# Altium schematic sheet Sample_Int.SchDoc
size A; DocumentNumber: 3; SheetNumber: 3; SheetTotal: 4
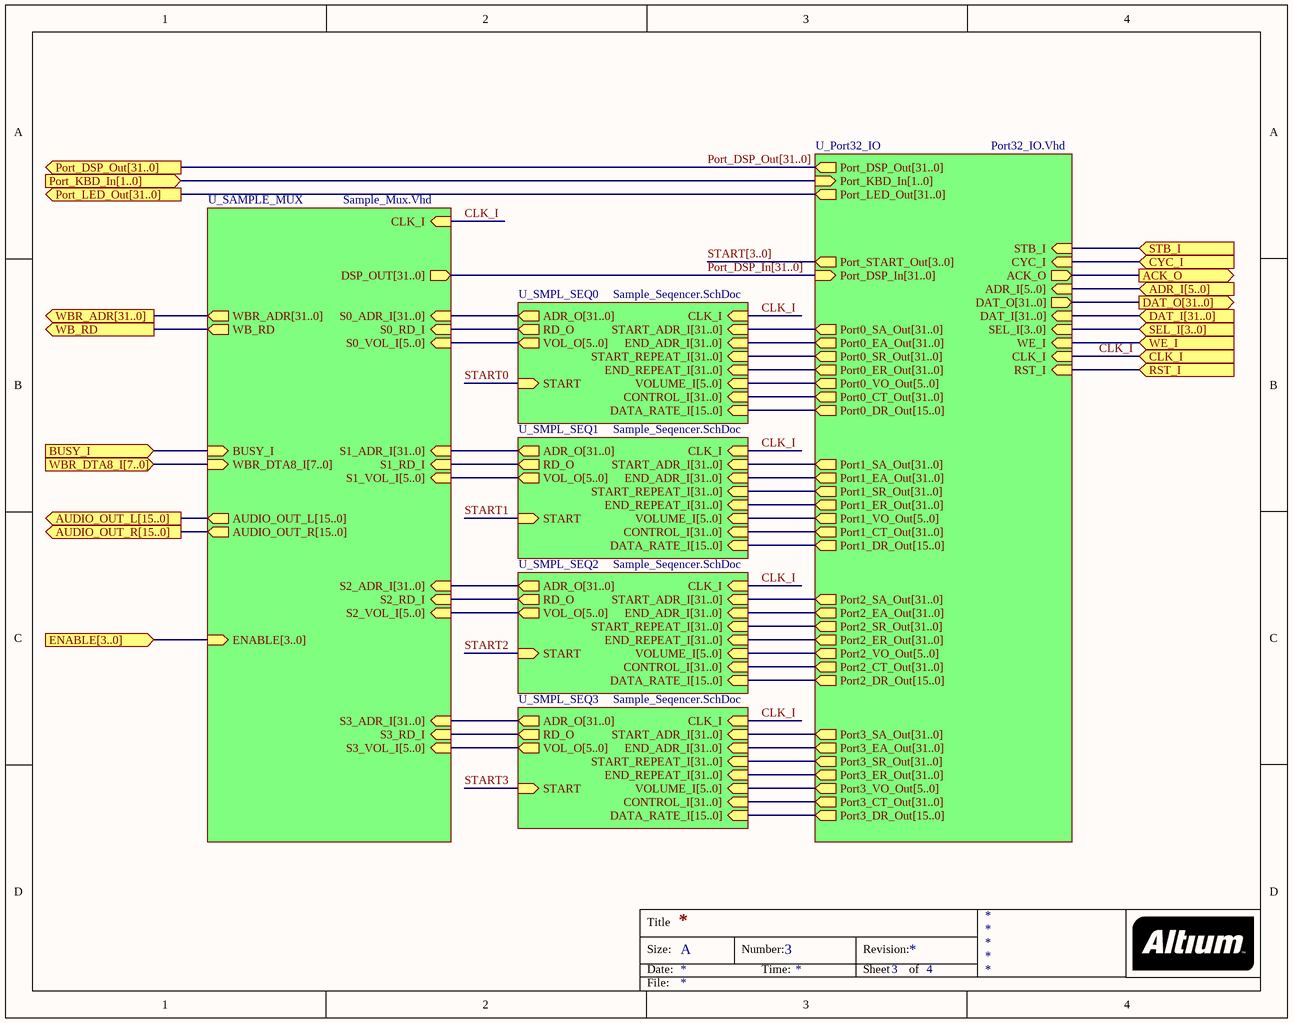
[diagram p0: Sample_Int.SchDoc]

## Sub-sheets
U_Port32_IO = Port32_IO.Vhd: Port_DSP_In[31..0] (in), Port0_SA_Out[31..0] (out), Port_DSP_Out[31..0] (out), Port0_EA_Out[31..0] (out), Port0_SR_Out[31..0] (out), Port0_ER_Out[31..0] (out), STB_I (in), WE_I (in), DAT_O[31..0] (out), DAT_I[31..0] (in), ADR_I[5..0] (in), SEL_I[3..0] (in), CLK_I (in), RST_I (in), ACK_O (out), CYC_I (in), Port0_VO_Out[5..0] (out), Port0_CT_Out[31..0] (out), Port0_DR_Out[15..0] (out), Port1_VO_Out[5..0] (out), Port1_SR_Out[31..0] (out), Port1_CT_Out[31..0] (out), Port1_ER_Out[31..0] (out), Port1_EA_Out[31..0] (out), Port1_SA_Out[31..0] (out), Port1_DR_Out[15..0] (out), Port2_VO_Out[5..0] (out), Port2_SR_Out[31..0] (out), Port2_CT_Out[31..0] (out), Port2_ER_Out[31..0] (out), Port2_EA_Out[31..0] (out), Port2_SA_Out[31..0] (out), Port2_DR_Out[15..0] (out), Port3_VO_Out[5..0] (out), Port3_SR_Out[31..0] (out), Port3_CT_Out[31..0] (out), Port3_ER_Out[31..0] (out), Port3_EA_Out[31..0] (out), Port3_SA_Out[31..0] (out), Port3_DR_Out[15..0] (out), Port_KBD_In[1..0] (in), Port_START_Out[3..0] (out), Port_LED_Out[31..0] (out)
U_SAMPLE_MUX = Sample_Mux.Vhd: S0_ADR_I[31..0] (in), S0_RD_I (in), WBR_ADR[31..0] (out), WB_RD (out), WBR_DTA8_I[7..0] (in), AUDIO_OUT_L[15..0] (out), AUDIO_OUT_R[15..0] (out), S1_ADR_I[31..0] (in), S2_ADR_I[31..0] (in), S3_ADR_I[31..0] (in), S1_RD_I (in), S2_RD_I (in), S3_RD_I (in), ENABLE[3..0] (in), CLK_I (in), BUSY_I (in), DSP_OUT[31..0] (out), S0_VOL_I[5..0] (in), S1_VOL_I[5..0] (in), S2_VOL_I[5..0] (in), S3_VOL_I[5..0] (in)
U_SMPL_SEQ0 = Sample_Seqencer.SchDoc: START_ADR_I[31..0] (in), END_ADR_I[31..0] (in), START_REPEAT_I[31..0] (in), END_REPEAT_I[31..0] (in), VOLUME_I[5..0] (in), CONTROL_I[31..0] (in), DATA_RATE_I[15..0] (in), CLK_I (in), ADR_O[31..0] (out), RD_O (out), START (in), VOL_O[5..0] (out)
U_SMPL_SEQ1 = Sample_Seqencer.SchDoc: START_ADR_I[31..0] (in), END_ADR_I[31..0] (in), START_REPEAT_I[31..0] (in), END_REPEAT_I[31..0] (in), VOLUME_I[5..0] (in), CONTROL_I[31..0] (in), DATA_RATE_I[15..0] (in), CLK_I (in), ADR_O[31..0] (out), RD_O (out), START (in), VOL_O[5..0] (out)
U_SMPL_SEQ2 = Sample_Seqencer.SchDoc: START_ADR_I[31..0] (in), END_ADR_I[31..0] (in), START_REPEAT_I[31..0] (in), END_REPEAT_I[31..0] (in), VOLUME_I[5..0] (in), CONTROL_I[31..0] (in), DATA_RATE_I[15..0] (in), CLK_I (in), ADR_O[31..0] (out), RD_O (out), START (in), VOL_O[5..0] (out)
U_SMPL_SEQ3 = Sample_Seqencer.SchDoc: START_ADR_I[31..0] (in), END_ADR_I[31..0] (in), START_REPEAT_I[31..0] (in), END_REPEAT_I[31..0] (in), VOLUME_I[5..0] (in), CONTROL_I[31..0] (in), DATA_RATE_I[15..0] (in), CLK_I (in), ADR_O[31..0] (out), RD_O (out), START (in), VOL_O[5..0] (out)

## Ports
ACK_O (out), ADR_I[5..0] (in), AUDIO_OUT_L[15..0] (out), AUDIO_OUT_R[15..0] (out), BUSY_I (in), CLK_I (in), CYC_I (in), DAT_I[31..0] (in), DAT_O[31..0] (out), ENABLE[3..0] (in), Port_DSP_Out[31..0] (out), Port_KBD_In[1..0] (in), Port_LED_Out[31..0] (out), RST_I (in), SEL_I[3..0] (in), STB_I (in), WB_RD (out), WBR_ADR[31..0] (out), WBR_DTA8_I[7..0] (in), WE_I (in)

## Nets
ACK_O: port ACK_O, sheet U_Port32_IO/ACK_O
BUSY_I: port BUSY_I, sheet U_SAMPLE_MUX/BUSY_I
CLK_I: port CLK_I, sheet U_Port32_IO/CLK_I, sheet U_SMPL_SEQ0/CLK_I, sheet U_SAMPLE_MUX/CLK_I, sheet U_SMPL_SEQ1/CLK_I, sheet U_SMPL_SEQ2/CLK_I, sheet U_SMPL_SEQ3/CLK_I
CYC_I: port CYC_I, sheet U_Port32_IO/CYC_I
RST_I: port RST_I, sheet U_Port32_IO/RST_I
START0: sheet U_SMPL_SEQ0/START
START1: sheet U_SMPL_SEQ1/START
START2: sheet U_SMPL_SEQ2/START
START3: sheet U_SMPL_SEQ3/START
STB_I: port STB_I, sheet U_Port32_IO/STB_I
WB_RD: port WB_RD, sheet U_SAMPLE_MUX/WB_RD
WE_I: port WE_I, sheet U_Port32_IO/WE_I
(unnamed): sheet U_SMPL_SEQ0/RD_O, sheet U_SAMPLE_MUX/S0_RD_I
(unnamed): sheet U_SAMPLE_MUX/S1_RD_I, sheet U_SMPL_SEQ1/RD_O
(unnamed): sheet U_SAMPLE_MUX/S2_RD_I, sheet U_SMPL_SEQ2/RD_O
(unnamed): sheet U_SAMPLE_MUX/S3_RD_I, sheet U_SMPL_SEQ3/RD_O

## Buses and harness runs
bus port ADR_I[5..0] = sheet U_Port32_IO/ADR_I[5..0]
bus port AUDIO_OUT_L[15..0] = sheet U_SAMPLE_MUX/AUDIO_OUT_L[15..0]
bus port AUDIO_OUT_R[15..0] = sheet U_SAMPLE_MUX/AUDIO_OUT_R[15..0]
bus port DAT_I[31..0] = sheet U_Port32_IO/DAT_I[31..0]
bus port DAT_O[31..0] = sheet U_Port32_IO/DAT_O[31..0]
bus port ENABLE[3..0] = sheet U_SAMPLE_MUX/ENABLE[3..0]
bus port Port_KBD_In[1..0] = sheet U_Port32_IO/Port_KBD_In[1..0]
bus port Port_LED_Out[31..0] = sheet U_Port32_IO/Port_LED_Out[31..0]
bus port SEL_I[3..0] = sheet U_Port32_IO/SEL_I[3..0]
bus port WBR_ADR[31..0] = sheet U_SAMPLE_MUX/WBR_ADR[31..0]
bus port WBR_DTA8_I[7..0] = sheet U_SAMPLE_MUX/WBR_DTA8_I[7..0]
bus Port_DSP_In[31..0] = sheet U_Port32_IO/Port_DSP_In[31..0] = sheet U_SAMPLE_MUX/DSP_OUT[31..0]
bus Port_DSP_Out[31..0] = port Port_DSP_Out[31..0] = sheet U_Port32_IO/Port_DSP_Out[31..0]
bus sheet U_Port32_IO/Port0_CT_Out[31..0] = sheet U_SMPL_SEQ0/CONTROL_I[31..0]
bus sheet U_Port32_IO/Port0_DR_Out[15..0] = sheet U_SMPL_SEQ0/DATA_RATE_I[15..0]
bus sheet U_Port32_IO/Port0_EA_Out[31..0] = sheet U_SMPL_SEQ0/END_ADR_I[31..0]
bus sheet U_Port32_IO/Port0_ER_Out[31..0] = sheet U_SMPL_SEQ0/END_REPEAT_I[31..0]
bus sheet U_Port32_IO/Port0_SA_Out[31..0] = sheet U_SMPL_SEQ0/START_ADR_I[31..0]
bus sheet U_Port32_IO/Port0_SR_Out[31..0] = sheet U_SMPL_SEQ0/START_REPEAT_I[31..0]
bus sheet U_Port32_IO/Port0_VO_Out[5..0] = sheet U_SMPL_SEQ0/VOLUME_I[5..0]
bus sheet U_Port32_IO/Port1_CT_Out[31..0] = sheet U_SMPL_SEQ1/CONTROL_I[31..0]
bus sheet U_Port32_IO/Port1_DR_Out[15..0] = sheet U_SMPL_SEQ1/DATA_RATE_I[15..0]
bus sheet U_Port32_IO/Port1_EA_Out[31..0] = sheet U_SMPL_SEQ1/END_ADR_I[31..0]
bus sheet U_Port32_IO/Port1_ER_Out[31..0] = sheet U_SMPL_SEQ1/END_REPEAT_I[31..0]
bus sheet U_Port32_IO/Port1_SA_Out[31..0] = sheet U_SMPL_SEQ1/START_ADR_I[31..0]
bus sheet U_Port32_IO/Port1_SR_Out[31..0] = sheet U_SMPL_SEQ1/START_REPEAT_I[31..0]
bus sheet U_Port32_IO/Port1_VO_Out[5..0] = sheet U_SMPL_SEQ1/VOLUME_I[5..0]
bus sheet U_Port32_IO/Port2_CT_Out[31..0] = sheet U_SMPL_SEQ2/CONTROL_I[31..0]
bus sheet U_Port32_IO/Port2_DR_Out[15..0] = sheet U_SMPL_SEQ2/DATA_RATE_I[15..0]
bus sheet U_Port32_IO/Port2_EA_Out[31..0] = sheet U_SMPL_SEQ2/END_ADR_I[31..0]
bus sheet U_Port32_IO/Port2_ER_Out[31..0] = sheet U_SMPL_SEQ2/END_REPEAT_I[31..0]
bus sheet U_Port32_IO/Port2_SA_Out[31..0] = sheet U_SMPL_SEQ2/START_ADR_I[31..0]
bus sheet U_Port32_IO/Port2_SR_Out[31..0] = sheet U_SMPL_SEQ2/START_REPEAT_I[31..0]
bus sheet U_Port32_IO/Port2_VO_Out[5..0] = sheet U_SMPL_SEQ2/VOLUME_I[5..0]
bus sheet U_Port32_IO/Port3_CT_Out[31..0] = sheet U_SMPL_SEQ3/CONTROL_I[31..0]
bus sheet U_Port32_IO/Port3_DR_Out[15..0] = sheet U_SMPL_SEQ3/DATA_RATE_I[15..0]
bus sheet U_Port32_IO/Port3_EA_Out[31..0] = sheet U_SMPL_SEQ3/END_ADR_I[31..0]
bus sheet U_Port32_IO/Port3_ER_Out[31..0] = sheet U_SMPL_SEQ3/END_REPEAT_I[31..0]
bus sheet U_Port32_IO/Port3_SA_Out[31..0] = sheet U_SMPL_SEQ3/START_ADR_I[31..0]
bus sheet U_Port32_IO/Port3_SR_Out[31..0] = sheet U_SMPL_SEQ3/START_REPEAT_I[31..0]
bus sheet U_Port32_IO/Port3_VO_Out[5..0] = sheet U_SMPL_SEQ3/VOLUME_I[5..0]
bus sheet U_SAMPLE_MUX/S0_ADR_I[31..0] = sheet U_SMPL_SEQ0/ADR_O[31..0]
bus sheet U_SAMPLE_MUX/S0_VOL_I[5..0] = sheet U_SMPL_SEQ0/VOL_O[5..0]
bus sheet U_SAMPLE_MUX/S1_ADR_I[31..0] = sheet U_SMPL_SEQ1/ADR_O[31..0]
bus sheet U_SAMPLE_MUX/S1_VOL_I[5..0] = sheet U_SMPL_SEQ1/VOL_O[5..0]
bus sheet U_SAMPLE_MUX/S2_ADR_I[31..0] = sheet U_SMPL_SEQ2/ADR_O[31..0]
bus sheet U_SAMPLE_MUX/S2_VOL_I[5..0] = sheet U_SMPL_SEQ2/VOL_O[5..0]
bus sheet U_SAMPLE_MUX/S3_ADR_I[31..0] = sheet U_SMPL_SEQ3/ADR_O[31..0]
bus sheet U_SAMPLE_MUX/S3_VOL_I[5..0] = sheet U_SMPL_SEQ3/VOL_O[5..0]
bus START[3..0] = sheet U_Port32_IO/Port_START_Out[3..0]

## Notes on the sheet
- Title
- Size:
- Date:
- A
- Number:
- Time:
- Revision:
- Sheet
- of
- File: